# EAGLE schematic untitled (EAGLE 6.6.0)
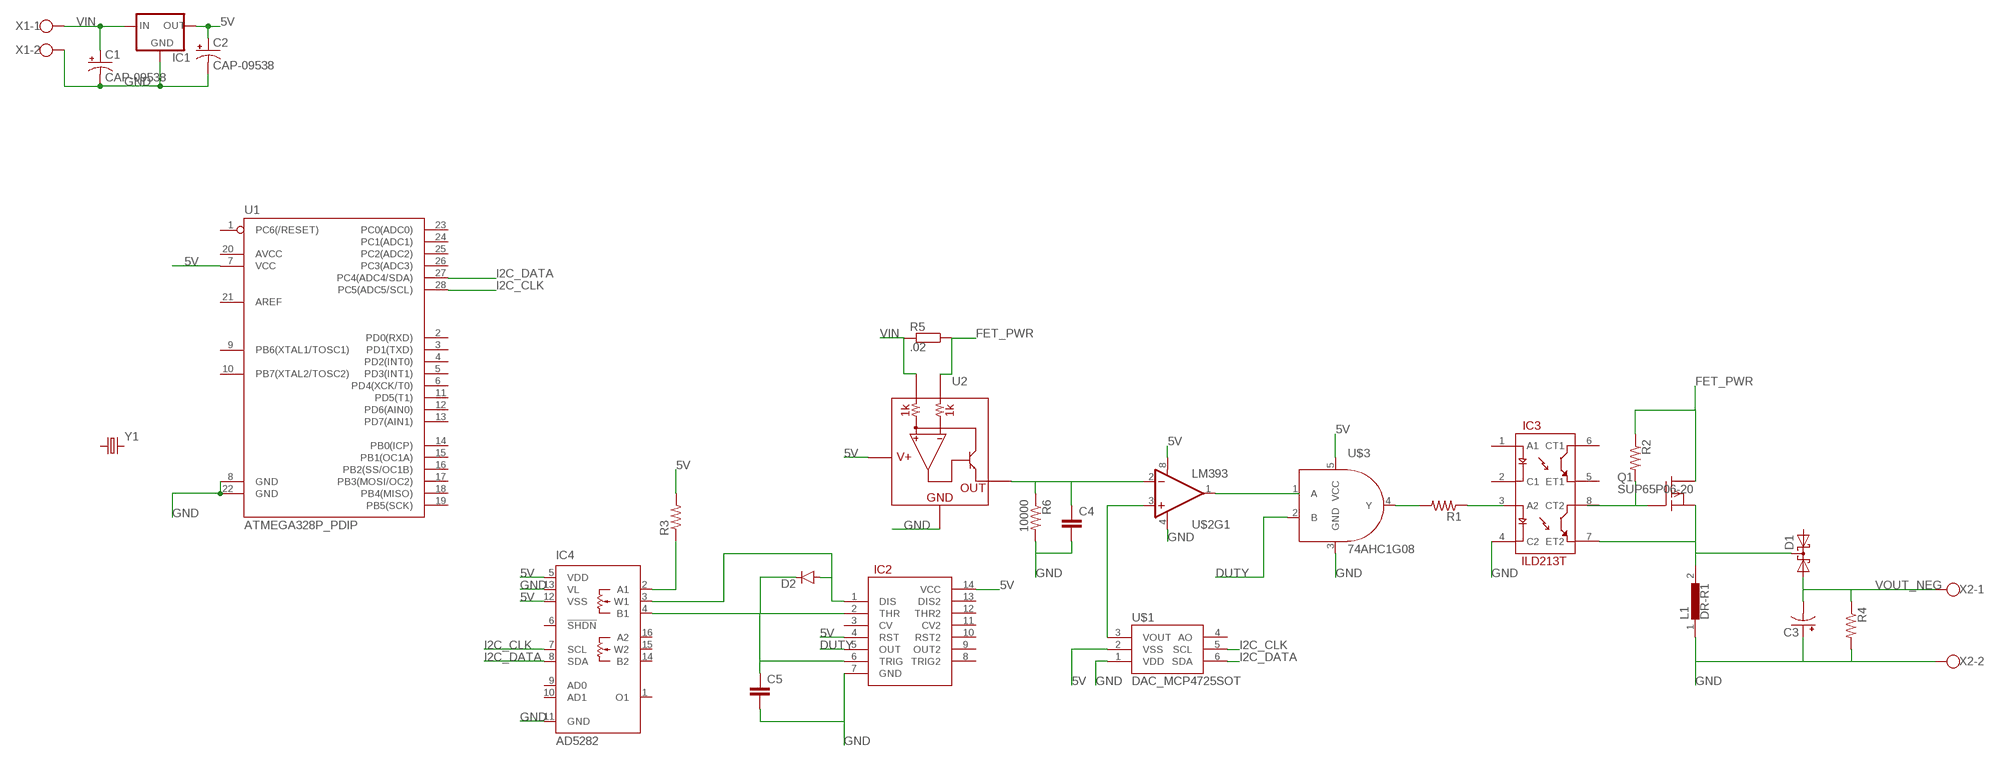
[diagram p0: schematic, sheet 1]

## Parts
C1  CAP-09538  1000UF-25V(PTH)  [CPOL-RADIAL-1000UF-25V]
C2  CAP-09538  1000UF-25V(PTH)  [CPOL-RADIAL-1000UF-25V]
C3  CAP_POLPTH3  [CPOL-RADIAL-1000UF-63V]
C4  CAP0805  [0805]
C5  CAP0805  [0805]
D1  DIODE_2SCHOTTKY-SOT82V  [SOT82S]
D2  DIODEPTH  [DIODE-1N4001]
IC1  V_REG_78XX-TO-220  [TO-220-ALT]
IC2  556  [DIL14]
IC3  ILD213T  [SO08]
IC4  AD5282  [TSSOP16]
L1  DR-R1  [DR-R1]
Q1  SUP65P06-20  [TO220]
R1  RESISTOR0402-RES  [0402-RES]
R2  RESISTOR0402-RES  [0402-RES]
R3  RESISTOR0402-RES  [0402-RES]
R4  RESISTOR0402-RES  [0402-RES]
R5  .02  SMR  [SMR]
R6  10000  RESISTOR0402-RES  [0402-RES]
U1  ATMEGA328P_PDIP  [DIL28-3]
U2  INA139  [SOT23-5]
U$1  DAC_MCP4725SOT  [SOT23-6]
U$2  LM393  [SO08]
U$3  74AHC1G08  [SOT23-5]
X1  W237-102  [W237-102]
X2  W237-102  [W237-102]
Y1  CRYSTALHC49US  [HC49US]

## Nets
5V: C2.+ IC1.OUT
DUTY: IC2.5(OUT)
FET_PWR: R5.1 U2.4(VIN-)
GND: C1.- C2.- IC1.GND X1.2
I2C_CLK: U1.28(PC5(ADC5/SCL))
I2C_DATA: U1.27(PC4(ADC4/SDA))
N$1: U1.8(GND) U1.22(GND)
N$2: IC4.5(VDD)
N$3: U$3.3(GND)
N$4: U1.7(VCC)
N$5: U$1.1(VDD)
N$6: U2.2(GND)
N$7: U2.5(V+)
N$8: U$1.2(VSS)
N$9: C5.2 IC2.7(GND)
N$10: IC2.14(VCC)
N$11: U$2.1(OUT) U$3.1(A)
N$12: C4.1 R6.1 U2.1(OUT) U$2.2(-IN)
N$13: U$3.2(B)
N$14: U$1.3(VOUT) U$2.3(+IN)
N$15: IC3.4(C2)
N$16: IC3.3(A2)
N$17: U$2.8(V+)
N$18: D1.C IC3.7(ET2) L1.2 Q1.3(S)
N$19: Q1.2(D) R2.1
N$20: R1.2 U$3.4(Y)
N$21: R1.1
N$22: IC3.8(CT2) Q1.1(G) R2.2
N$23: U$2.4(V-)
N$24: U$3.5(VCC)
N$25: U$1.5(SCL)
N$26: U$1.6(SDA)
N$27: IC4.13(VL)
N$28: IC4.7(SCL)
N$29: IC4.8(SDA)
N$30: IC4.11(GND)
N$31: IC4.2(A1) R3.1
N$32: R5.2 U2.3(VIN+)
N$33: IC4.12(VSS)
N$34: C3.1(+) L1.1 R4.2 X2.2
N$35: C5.1 D2.C IC2.2(THR) IC2.6(TRIG) IC4.4(B1)
N$36: R3.2
N$37: D2.A IC2.1(DIS) IC4.3(W1)
N$38: IC2.4(RST)
N$39: C4.2 R6.2
VIN: C1.+ IC1.IN X1.1
VOUT_NEG: C3.2(-) D1.A1 R4.1 X2.1
Unconnected: D1.A2 IC2.3(CV) IC2.8(TRIG2) IC2.9(OUT2) IC2.10(RST2) IC2.11(CV2) IC2.12(THR2) IC2.13(DIS2) IC3.1(A1) IC3.2(C1) IC3.5(ET1) IC3.6(CT1) IC4.1(O1) IC4.6(!SHDN) IC4.9(AD0) IC4.10(AD1) IC4.14(B2) IC4.15(W2) IC4.16(A2) U1.1(PC6(/RESET)) U1.2(PD0(RXD)) U1.3(PD1(TXD)) U1.4(PD2(INT0)) U1.5(PD3(INT1)) U1.6(PD4(XCK/T0)) U1.9(PB6(XTAL1/TOSC1)) U1.10(PB7(XTAL2/TOSC2)) U1.11(PD5(T1)) U1.12(PD6(AIN0)) U1.13(PD7(AIN1)) U1.14(PB0(ICP)) U1.15(PB1(OC1A)) U1.16(PB2(SS/OC1B)) U1.17(PB3(MOSI/OC2)) U1.18(PB4(MISO)) U1.19(PB5(SCK)) U1.20(AVCC) U1.21(AREF) U1.23(PC0(ADC0)) U1.24(PC1(ADC1)) U1.25(PC2(ADC2)) U1.26(PC3(ADC3)) U$1.4(AO) U$2.5(+IN) U$2.6(-IN) U$2.7(OUT) Y1.1 Y1.2

## Library data of the parts
C1 C2 = SparkFun-Capacitors:1000UF-25V(PTH): CAP-08070; PROD_ID: CAP-09538
C3 = SparkFun-Capacitors:CAP_POL: Capacitor Polarized These are standard SMD and PTH capacitors. Normally 10uF, 47uF, and 100uF in electrolytic and tantalum varieties. Always verify the external diameter of the through hole cap, it varies with capacity, voltage, and manufacturer. The EIA devices should be standard.
C4 C5 = SparkFun-Passives:CAP: Capacitor Standard 0603 ceramic capacitor, and 0.1" leaded capacitor.
D1 = diode:DIODE_2SCHOTTKY-: Dual SCHOTTKY DIODE common cathode
D2 = SparkFun-DiscreteSemi:DIODE: Diode These are standard reverse protection diodes and small signal diodes. SMA package can handle up to about 1A. SOD-323 can handle about 200mA. What the SOD-323 package when ordering, there are some mfgs out there that are 5-pin packages.
IC1 = SparkFun-PowerIC:V_REG_78XX: Voltage Regulator Standard 7805 5V regulator. IGO (Input Ground Output). Spark Fun Electronics SKU : COM-00107
IC2 = SparkFun-AnalogIC:556: Dual timer circuit (2 555 timers in one package)
IC3 = SparkFun-DiscreteSemi:ILD213T: Dual optoisolator.
IC4 = analog-devices:AD5282: Dual +15 V/±5 V, 256-Position, I2C-Compatible Digital Potentiometer Source: http://www.analog.com/static/imported-files/data_sheets/AD5280_5282.pdf; MF: ALTERA CORPORATION; MPN: AD5282BRUZ50; OC_FARNELL: 1438442; OC_NEWARK: 59K3850
L1 = inductors:DR-R1: INDUCTOR
Q1 = transistor-fet:SUP65P06-20: P-Channel Enhancement MOSFET -60V; 60A; 0,020Ohm
R1-R4 R6 = SparkFun-Passives:RESISTOR: Resistor Basic schematic elements and footprints for 0603, 1206, and PTH resistors.
R5 = resistor-shunt:SMR: SMD SHUNT RESISTOR; OC_FARNELL: unknown; OC_NEWARK: unknown
U1 = SparkFun-DigitalIC:ATMEGA328P_PDIP: uC used in the Arduino 32kb flash, 1k EEPROM, 2k SRAM This is the through-hole version of this chip.
U2 = SparkFun-AnalogIC:INA139: High-side shunt current sense 2.7V-40V, 1%
U$1 = SparkFun-AnalogIC:DAC_MCP4725: Microchip 12-bit I2C DAC, SOT23-6
U$2 = SparkFun-AnalogIC:LM393: Low-voltage comparator
U$3 = SparkFun-DigitalIC:74AHC1G08: Single 2-input AND gate
X1 X2 = con-wago-500:W237-102: WAGO SCREW CLAMP; MPN: 237-102; OC_FARNELL: unknown; OC_NEWARK: 70K9898
Y1 = SparkFun-FreqCtrl:CRYSTAL: Various standard crystals. Proven footprints. Spark Fun Electronics SKU : COM-00534